# Altium schematic sheet regulator9V.SchDoc
size A; SheetNumber: 1; SheetTotal: 1
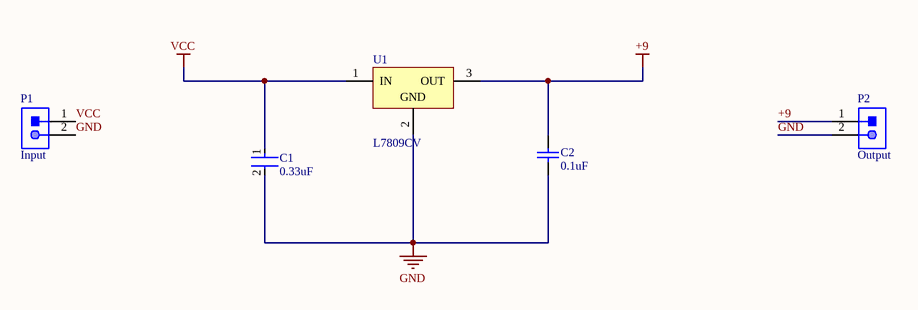
[diagram p0: regulator9V.SchDoc]

## Parts
C1  0.33uF  [FP-RDE1K1-MFG]
C2  0.1uF  [AVX-SA115C104KAR]
P1  Input  [JST-S2B-PH-K-S_V]
P2  Output  [JST-S2B-PH-K-S_V]
U1  L7809CV  [TO220]

## Nets
+9: C2.2 P2.1 U1.3(OUT)
GND: C1.2 C2.1 P1.2 P2.2 U1.2(GND)
VCC: C1.1 P1.1 U1.1(IN)

## Library data of the parts
C1 = CMP-06035-014941-1: Ceramic Capacitor 330nF ±10% 50V X7R Radial; Lead/Base Style: Kinked; Lead Diameter: 0.5mm; Height - Seated (Max): 0.197inch; Max Operating Temperature: 125°C; Resistor Type: Ceramic; Lead Free: Lead Free; Package Quantity: 2000; Termination: Radial; Voltage Rating: 50V; Tolerance: 10%; Mount: Through Hole; Voltage Rating (DC): 50V; Min Operating Temperature: -55°C; Case/Package: Radial; Packaging: Tape and Reel; Dielectric: X7R; Lead Pitch: 0.197inch; Height: 3.5mm; Length: 0.177inch; Width: 0.124inch; Capacitance: 330nF
C2 = CMP-2000-07029-1: Axial Leads / SpinGuard(R), Ceramic Capacitor, 0.10 uF +/- 10%, 50V, -55 to 125 degC, 2-Pin THD, RoHS, Tape and Reel; Manufacturer: AVX; Other Names: 478-3151-1; Catalog Drawings: SASeries_4.32x3.05; Capacitance: 0.1µF; Temperature Coefficient: X7R; Online Catalog: SpinGuard®SASeries; Product Training Modules: ComponentSolutionsforSmartMeterApplications; Category: Capacitors; Package Description: 2-Pin Axial Lead, Dia 3.05 mm, Body Length 4.32 mm; Standard Package: 1; Mounting Technology: ThroughHole; Ratings: -; Datasheet Version: 06/2007; Voltage - Rated: 50V; Tolerance: ±10%; Package Reference: SA115C104KAR; Packaging: -; Lead Style: -; Size / Dimension: 0.120"Diax0.170"L(3.05mmx4.32mm); Mounting Type: ThroughHole; Operating Temperature: -55°C~125°C; Datasheet URL: https://datasheet.ciiva.com/27051/1074183-27051369.pdf; Applications: GeneralPurpose; Thickness (Max): -; Lead Spacing: -; Height - Seated (Max): -; Family: CeramicCapacitors; Package / Case: Axial; Features: -; Series: SpinGuard®SA; Manufacturer URL: http://www.avx.com/
P1 P2 = CMP-1755-00004-1: Male Header, Pitch 2 mm, 1 x 2 Position, Height 4.8 mm, Tail Length 3.4 mm, -25 to 85 degC, RoHS, Bulk; Case\Package: Radial; Tolerance: 20%; Capacitance: 10 uF; Voltage Rating (DC): 50 V; Packaging: Bulk; ComponentLink1URL: http://www.jst-mfg.com/product/pdf/eng/ePH.pdf; Radiation Hardening: No; Height: 11 mm; Package Quantity: 200; PackageDescription: Male Header, Pitch 2 mm, 1 x 2 Position, Height 4.8 mm, Tail Length 3.4 mm; PackageReference: S2B-PH-K-S; Diameter: 5 mm; Pins: 2; Mount: Through Hole; Max Operating Temperature: 85 degC; Min Operating Temperature: -40 degC; ComponentLink1Description: Datasheet; DatasheetVersion: Dec-12; Length: 11 mm; Lead Pitch: 2 mm; REACH SVHC: No SVHC; Voltage Rating: 50 V; RoHSCompliant: true
U1 = CMP-0244-00459-1: Positive Voltage Regulator, 9V, 3-Pin TO-220; ComponentLink3URL: http://www.st.com/internet/com/TECHNICAL_RESOURCES/TECHNICAL_LITERATURE/PACKAGE_INFORMATION/CD00004649.pdf; ComponentLink2Description: Datasheet; DatasheetVersion: 16/11/2011; PackageVersion: ver3.0; PackageDescription: TO, Thru-Hole, Vertical, Heatsink Mounted; 3 In-Line Leads; Pitch 2.54 mm; ComponentLink3Description: Package Specification; ComponentLink2URL: http://www.st.com/internet/com/TECHNICAL_RESOURCES/TECHNICAL_LITERATURE/DATASHEET/CD00000444.pdf; ComponentLink1URL: http://www.st.com; ComponentLink1Description: Manufacturer URL; PackageReference: TO220